# Altium schematic sheet FCStellarisSCH.SchDoc
size 355 x 254 mm
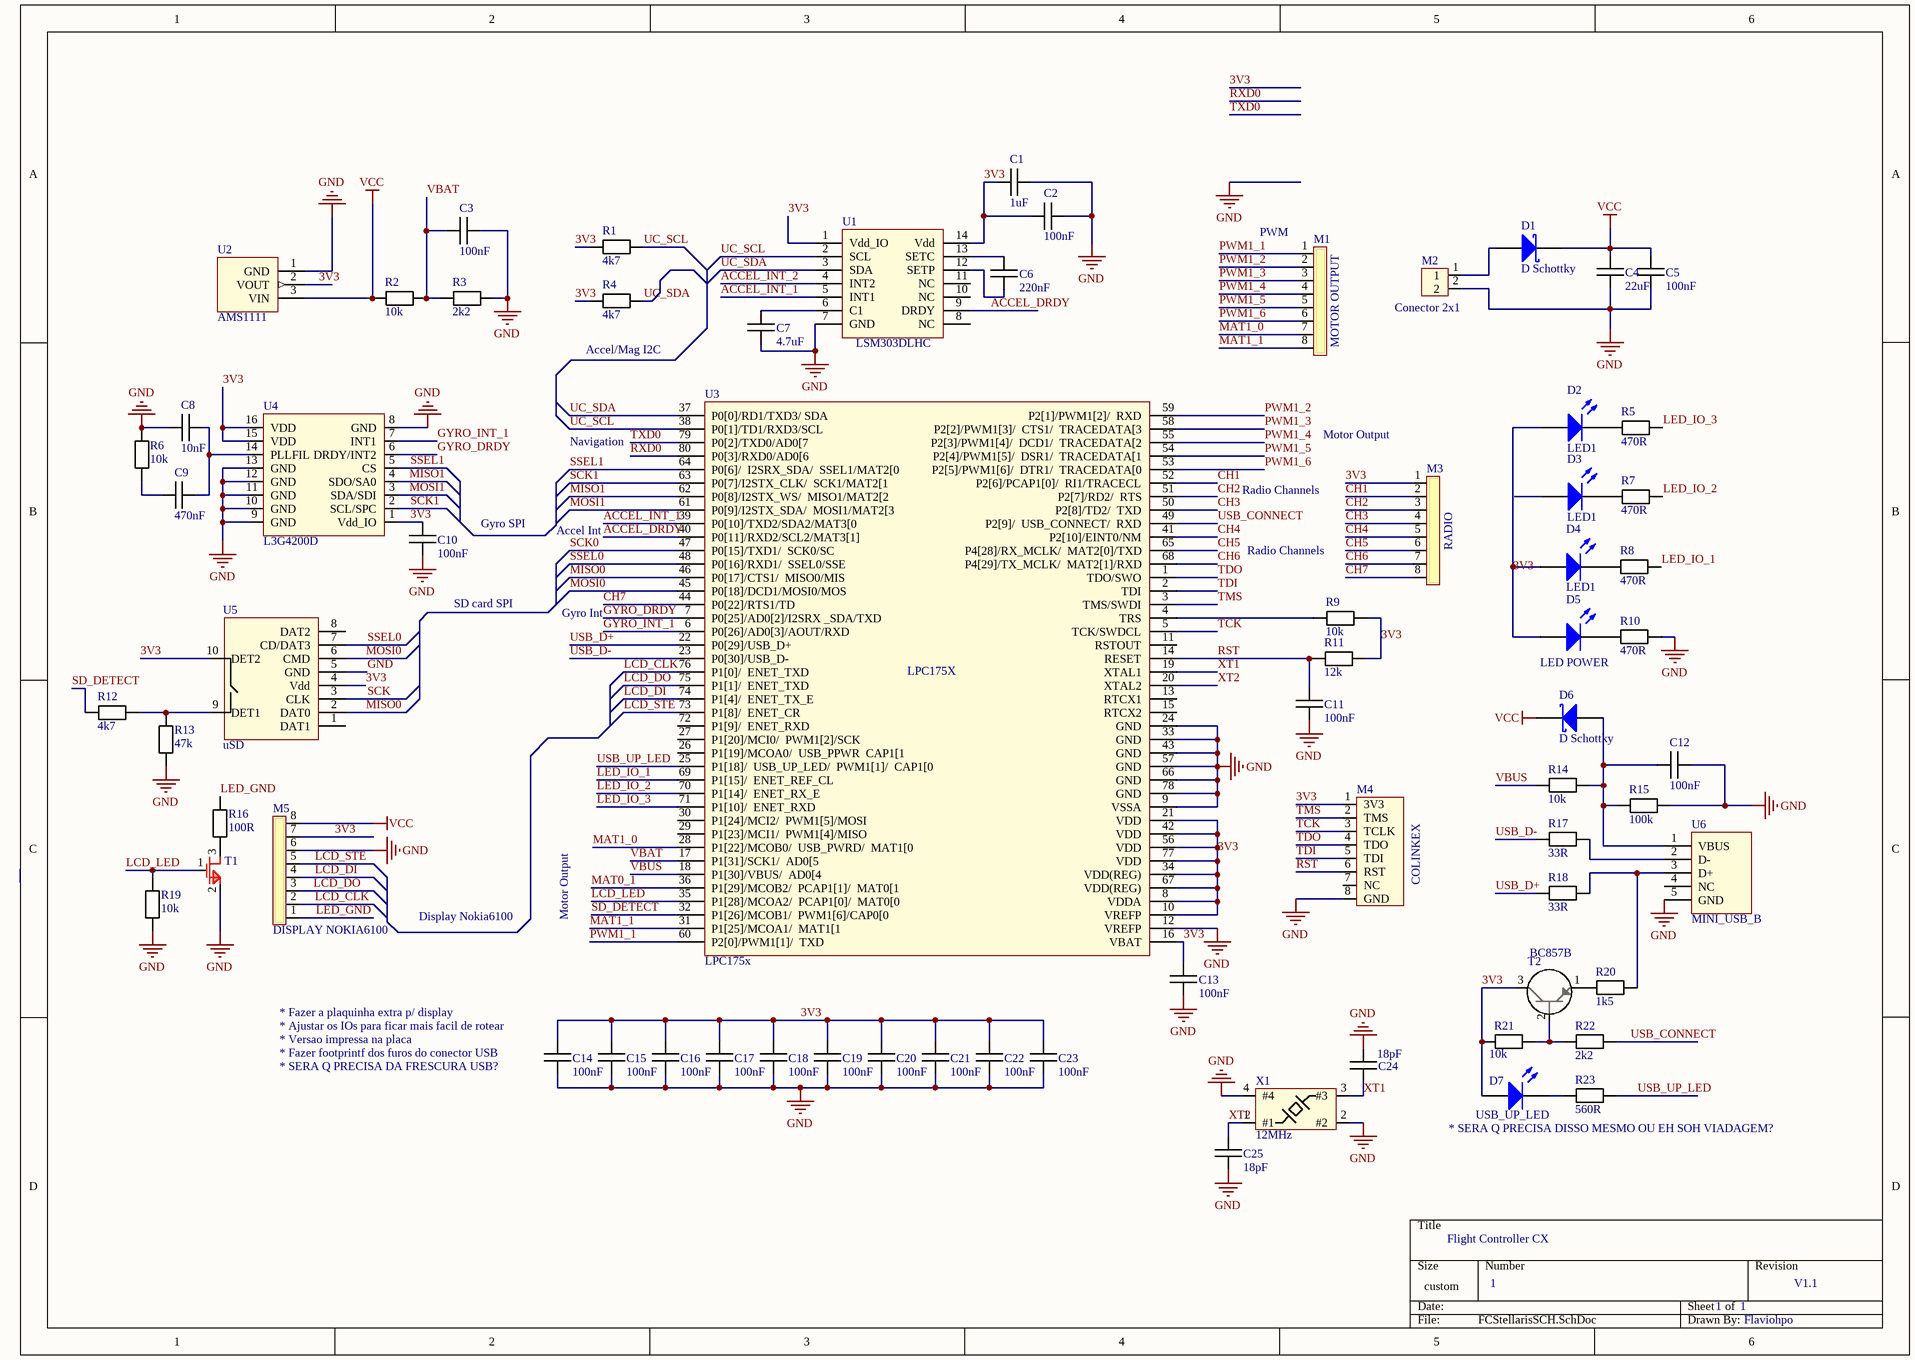
[diagram p0: FCStellarisSCH.SchDoc]

## Parts
C1  1uF  [Capacitor 0805]
C2  100nF  [Capacitor 0805]
C3  100nF  [Capacitor 0805]
C4  22uF  [Capacitor 0805]
C5  100nF  [Capacitor 0805]
C6  220nF  [Capacitor 0805]
C7  4.7uF  [Capacitor 0805]
C8  10nF  [Capacitor 0805]
C9  470nF  [Capacitor 0805]
C10  100nF  [Capacitor 0805]
C11  100nF  [Capacitor 0805]
C12  100nF  [Capacitor 0805]
C13  100nF  [Capacitor 0805]
C14  100nF  [Capacitor 0805]
C15  100nF  [Capacitor 0805]
C16  100nF  [Capacitor 0805]
C17  100nF  [Capacitor 0805]
C18  100nF  [Capacitor 0805]
C19  100nF  [Capacitor 0805]
C20  100nF  [Capacitor 0805]
C21  100nF  [Capacitor 0805]
C22  100nF  [Capacitor 0805]
C23  100nF  [Capacitor 0805]
C24  18pF  [Capacitor 0805]
C25  18pF  [Capacitor 0805]
D1  D Schottky  [SMB]
D2  LED1  [led0805]
D3  LED1  [led0805]
D4  LED1  [led0805]
D5  LED POWER  [3.2X1.6X1.1]
D6  D Schottky  [SMB]
D7  USB_UP_LED  [led0805]
M1  MOTOR OUTPUT  [Molex8 1.25 pitch Housing SMD]
M2  Conector 2x1  [Con256M2x1]
M3  RADIO  [Molex8 1.25 pitch Housing SMD]
M4  COLINKEX  [PinHead8 2.54mm]
M5  DISPLAY NOKIA6100  [Molex8 1.25 pitch Housing SMD]
R1  4k7  [Resistor 0805]
R2  10k  [Resistor 0805]
R3  2k2  [Resistor 0805]
R4  4k7  [Resistor 0805]
R5  470R  [Resistor 0805]
R6  10k  [Resistor 0805]
R7  470R  [Resistor 0805]
R8  470R  [Resistor 0805]
R9  10k  [Resistor 0805]
R10  470R  [Resistor 0805]
R11  12k  [Resistor 0805]
R12  4k7  [Resistor 0805]
R13  47k  [Resistor 0805]
R14  10k  [Resistor 0805]
R15  100k  [Resistor 0805]
R16  100R  [Resistor 0805]
R17  33R  [Resistor 0805]
R18  33R  [Resistor 0805]
R19  10k  [Resistor 0805]
R20  1k5  [Resistor 0805]
R21  10k  [Resistor 0805]
R22  2k2  [Resistor 0805]
R23  560R  [Resistor 0805]
T1  MOSFET_NPN  [SOT23 - 123]  (value not drawn)
T2  BC857B  [SOT23 - 213]
U1  LSM303DLHC  [LGA-14]
U2  AMS1111  [AMS1111]
U3  LPC175x  [SQFP50P1400X1400-80L]
U4  L3G4200D  [LGA16]
U5  uSD  [MICRO SDCARD]
U6  MINI_USB_B  [USB_MINI_B]
X1  12MHz  [XTAL-3.2x2.5]

## Nets
GND: C1.1 C2.2 C3.2 C4.1 C5.1 C7.2 C8.2 C10.2 C11.1 C12.2 C13.1 C14.1 C15.1 C16.1 C17.1 C18.1 C19.1 C20.1 C21.1 C22.1 C23.1 C24.2 C25.1 M2.2 M4.8(GND) M5.6 R3.2 R6.1 R10.2 R13.1 R15.2 R19.1 T1.2(S) U1.7(GND) U2.1(GND) U3.9(VSSA) U3.12(VREFP) U3.24(GND) U3.33(GND) U3.43(GND) U3.57(GND) U3.66(GND) U3.78(GND) U4.8(GND) U4.9(GND) U4.10(GND) U4.11(GND) U4.12(GND) U4.13(GND) U5.5(GND) U6.5(GND) X1.2(#2) X1.4(#4)
VCC: C4.2 C5.2 D1.2(K) D6.2(K) M5.8 R2.1 U2.3(VIN)
3V3: C1.2 C2.1 C10.1 C13.2 C14.2 C15.2 C16.2 C17.2 C18.2 C19.2 C20.2 C21.2 C22.2 C23.2 D2.1(A) D4.1(A) D5.1(A) D7.1(A) M3.1 M4.1(3V3) M5.7 R1.1 R4.1 R9.1 R11.1 R21.2 T2.3(C) U1.1(Vdd_IO) U1.14(Vdd) U2.2(VOUT) U3.8(VDDA) U3.10(VREFP) U3.16(VBAT) U3.21(VDD) U3.34(VDD(REG)) U3.42(VDD) U3.56(VDD) U3.67(VDD(REG)) U3.77(VDD) U4.1(Vdd_IO) U4.15(VDD) U4.16(VDD) U5.4(Vdd) U5.10(DET2)
ACCEL_DRDY: U1.9(DRDY) U3.40(P0[11]/RXD2/SCL2/MAT3[1])
ACCEL_INT_1: U1.5(INT1) U3.39(P0[10]/TXD2/SDA2/MAT3[0)
ACCEL_INT_2: U1.4(INT2)
CH1: M3.2 U3.52(P2[6]/PCAP1[0]/__RI1/TRACECL)
CH2: M3.3 U3.51(P2[7]/RD2/__RTS)
CH3: M3.4 U3.50(P2[8]/TD2/__TXD)
CH4: M3.5 U3.41(P2[10]/EINT0/NM)
CH5: M3.6 U3.65(P4[28]/RX_MCLK/__MAT2[0]/TXD)
CH6: M3.7 U3.68(P4[29]/TX_MCLK/__MAT2[1]/RXD)
CH7: M3.8 U3.44(P0[22]/RTS1/TD)
GYRO_DRDY: U3.7(P0[25]/AD0[2]/I2SRX__SDA/TXD) U4.6(DRDY/INT2)
GYRO_INT_1: U3.6(P0[26]/AD0[3]/AOUT/RXD) U4.7(INT1)
LCD_CLK: M5.2 U3.76(P1[0]/__ENET_TXD)
LCD_DI: M5.4 U3.74(P1[4]/__ENET_TX_E)
LCD_DO: M5.3 U3.75(P1[1]/__ENET_TXD)
LCD_LED: R19.2 T1.1(G) U3.35(P1[28]/MCOA2/__PCAP1[0]/__MAT0[0)
LCD_STE: M5.5 U3.73(P1[8]/__ENET_CR)
LED_GND: M5.1 R16.2
LED_IO_1: R8.2 U3.69(P1[15]/__ENET_REF_CL)
LED_IO_2: R7.2 U3.70(P1[14]/__ENET_RX_E)
LED_IO_3: R5.2 U3.71(P1[10]/__ENET_RXD)
MAT0_1: U3.36(P1[29]/MCOB2/__PCAP1[1]/__MAT0[1)
MAT1_0: M1.7 U3.28(P1[22]/MCOB0/__USB_PWRD/__MAT1[0)
MAT1_1: M1.8 U3.31(P1[25]/MCOA1/__MAT1[1)
MISO0: U3.46(P0[17]/CTS1/__MISO0/MIS) U5.2(DAT0)
MISO1: U3.62(P0[8]/I2STX_WS/__MISO1/MAT2[2) U4.4(SDO/SA0)
MOSI0: U3.45(P0[18]/DCD1/MOSI0/MOS) U5.6(CMD)
MOSI1: U3.61(P0[9]/I2STX_SDA/__MOSI1/MAT2[3) U4.3(SDA/SDI)
PWM1_1: M1.1 U3.60(P2[0]/PWM1[1]/__TXD)
PWM1_2: M1.2 U3.59(P2[1]/PWM1[2]/__RXD)
PWM1_3: M1.3 U3.58(P2[2]/PWM1[3]/__CTS1/__TRACEDATA[3)
PWM1_4: M1.4 U3.55(P2[3]/PWM1[4]/__DCD1/__TRACEDATA[2)
PWM1_5: M1.5 U3.54(P2[4]/PWM1[5]/__DSR1/__TRACEDATA[1)
PWM1_6: M1.6 U3.53(P2[5]/PWM1[6]/__DTR1/__TRACEDATA[0)
RST: C11.2 M4.6(RST) R11.2 U3.14(RESET)
RXD0: U3.80(P0[3]/RXD0/AD0[6)
SCK: U5.3(CLK)
SCK0: U3.47(P0[15]/TXD1/__SCK0/SC)
SCK1: U3.63(P0[7]/I2STX_CLK/__SCK1/MAT2[1) U4.2(SCL/SPC)
SD_DETECT: R12.1 U3.32(P1[26]/MCOB1/__PWM1[6]/CAP0[0)
SSEL0: U3.48(P0[16]/RXD1/__SSEL0/SSE) U5.7(CD/DAT3)
SSEL1: U3.64(P0[6]/__I2SRX_SDA/__SSEL1/MAT2[0) U4.5(CS)
TCK: M4.3(TCLK) U3.5(TCK/SWDCL)
TDI: M4.5(TDI) U3.2(TDI)
TDO: M4.4(TDO) U3.1(TDO/SWO)
TMS: M4.2(TMS) U3.3(TMS/SWDI)
TXD0: U3.79(P0[2]/TXD0/AD0[7)
UC_SCL: R1.2 U1.2(SCL) U3.38(P0[1]/TD1/RXD3/SCL)
UC_SDA: R4.2 U1.3(SDA) U3.37(P0[0]/RD1/TXD3/_SDA)
USB_CONNECT: R22.1 U3.49(P2[9]/__USB_CONNECT/__RXD)
USB_D+: R18.1 U3.22(P0[29]/USB_D+)
USB_D-: R17.1 U3.23(P0[30]/USB_D-)
USB_UP_LED: R23.1 U3.25(P1[18]/__USB_UP_LED/__PWM1[1]/__CAP1[0)
VBAT: C3.1 R2.2 R3.1 U3.17(P1[31]/SCK1/__AD0[5)
VBUS: R14.1 U3.18(P1[30]/VBUS/__AD0[4)
XT1: C24.1 U3.19(XTAL1) X1.3(#3)
XT2: C25.2 U3.20(XTAL2) X1.1(#1)
NetC6_1: C6.1 U1.12(SETP)
NetC6_2: C6.2 U1.13(SETC)
NetC7_1: C7.1 U1.6(C1)
NetC8_1: C8.1 C9.1 U4.14(PLLFIL)
NetC9_2: C9.2 R6.2
NetC12_1: C12.1 D6.1(A) R14.2 R15.1 U6.1(VBUS)
NetD1_1: D1.1(A) M2.1
NetD2_2: D2.2(K) R5.1
NetD3_2: D3.2(K) R7.1
NetD4_2: D4.2(K) R8.1
NetD5_2: D5.2(K) R10.1
NetD7_2: D7.2(K) R23.2
NetR9_2: R9.2 U3.4(TRS)
NetR12_2: R12.2 R13.2 U5.9(DET1)
NetR16_1: R16.1 T1.3(D)
NetR17_2: R17.2 U6.2(D-)
NetR18_2: R18.2 R20.1 U6.3(D+)
NetR20_2: R20.2 T2.1(E)
NetR21_1: R21.1 R22.2 T2.2(B)

Not connected (* = marked no-connect by the designer): D3 1(A); M4 7(NC); U1 8(NC) 10(NC) 11(NC); U3 11(RSTOUT) 13(RTCX1) 15(RTCX2) 26(P1[19]/MCOA0/__USB_PPWR__CAP1[1) 27(P1[20]/MCI0/__PWM1[2]/SCK) 29(P1[23]/MCI1/__PWM1[4]/MISO) 30(P1[24]/MCI2/__PWM1[5]/MOSI) 72(P1[9]/__ENET_RXD); U5 1(DAT1) 8(DAT2); U6 4(NC)

## Notes on the sheet
- (near M1) PWM
- (near R4) Accel/Mag I2C
- (near M3) Motor Output
- Navigation
- Radio Channels
- Gyro SPI
- Accel Int
- SD card SPI
- Gyro Int
- Display Nokia6100
- Motor Output
- (near C14) * Ajustar os IOs para ficar mais facil de rotear
- * Fazer a plaquinha extra p/ display
- * Versao impressa na placa
- (near C14) * Fazer footprintf dos furos do conector USB
- * SERA Q PRECISA DA FRESCURA USB?
- * SERA Q PRECISA DISSO MESMO OU EH SOH VIADAGEM?
- Flight Controller CX
- 1
- V1.1
- Flaviohpo
- (in symbol LPC175x) LPC175X

## Library data of the parts
C1-C25 = Capacitor
D1 D6 = D Schottky: Schottky Diode; Published: 8-Jun-2000; LatestRevisionDate: 17-Jul-2002; LatestRevisionNote: Re-released for DXP Platform.; PackageReference: SMB; Publisher: Altium Limited; PackageDescription: DO-214-AA/SMB; 2 C-Bend Leads; Body 5.3 x 3.6 mm, inc. leads (LxW); Code_JEDEC: DO-214-AA
D2 D3 D7 = LED1: Typical RED GaAs LED; Published: 8-Jun-2000; LatestRevisionDate: 08-Jul-2005; LatestRevisionNote: Mech Layer 1 removed.; PackageReference: LED-1; Publisher: Altium Limited; PackageDescription: LED; 2 Leads
D4 D5 = LED2: Typical RED, GREEN, YELLOW, AMBER GaAs LED; Published: 8-Jun-2000; LatestRevisionDate: 17-Jul-2002; LatestRevisionNote: Re-released for DXP Platform.; PackageVersion: Feb-2002; PackageReference: 3.2X1.6X1.1; Publisher: Altium Limited; PackageDescription: SM LED; 2 Flat Leads
M1 M3 M5 = conector127-8x1
M2 = conector254-2x1
M4 = JTAG_COLINKEX
R1-R23 = Resisitor
U1 = LSM303DLHC: 3-axis Compass and accelerometer I2C Interface
U2 = AMS1111: 3.3V Linear Regulator
U4 = L3G4200D: Digital Gyroscope 3-axis
U5 = MICROSD
X1 = XTAL4PIN